# Altium project realsense_cable_board.PrjPcb
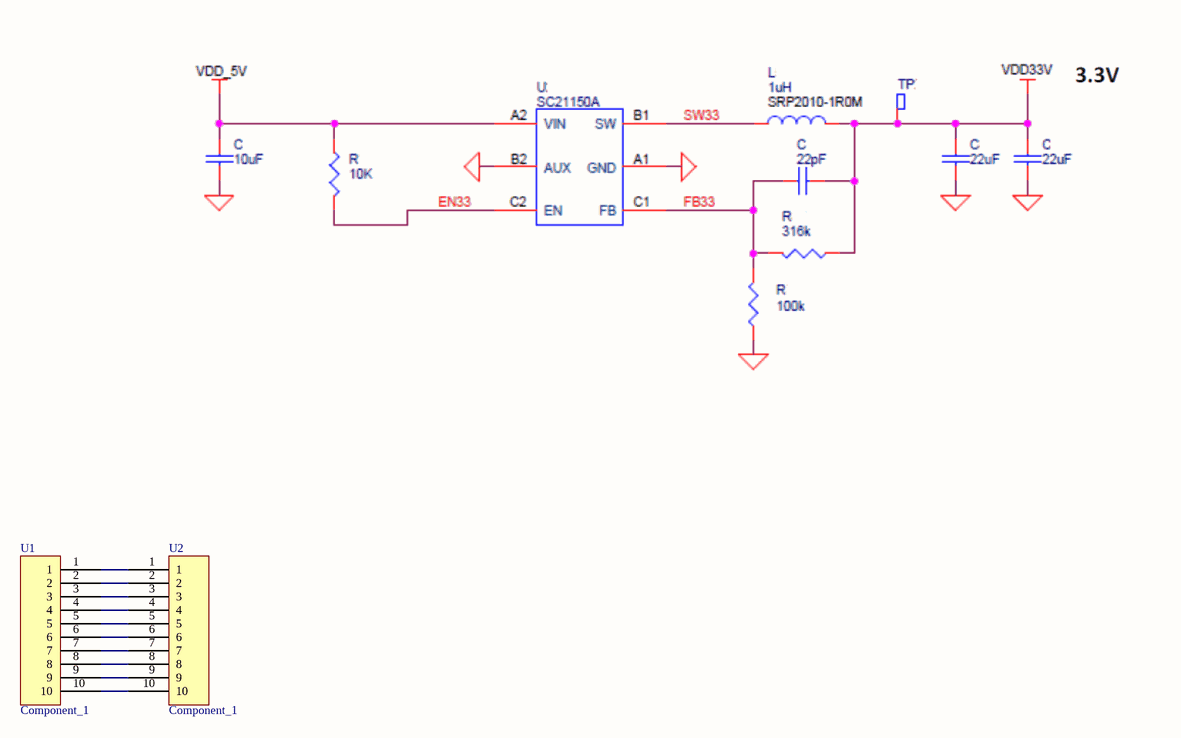
[diagram p0: realsense_bridge.SchDoc]
1 sheet, 2 parts. Net scope: global (net labels, ports and power ports of the same name join across sheets).
Board file: realsense_bridge.PcbDoc

## Sheet realsense_bridge.SchDoc
size A4; SheetNumber: 1; SheetTotal: 1

### Parts
U1  Component_1  [IPEX-20346-10T]
U2  Component_1  [FPC0.5 2H-WS-10P]

### Nets
NetU1_1: U1.1 U2.1
NetU1_2: U1.2 U2.2
NetU1_3: U1.3 U2.3
NetU1_4: U1.4 U2.4
NetU1_5: U1.5 U2.5
NetU1_6: U1.6 U2.6
NetU1_7: U1.7 U2.7
NetU1_8: U1.8 U2.8
NetU1_9: U1.9 U2.9
NetU1_10: U1.10 U2.10